# EAGLE schematic shield Arduino (EAGLE 6.1)
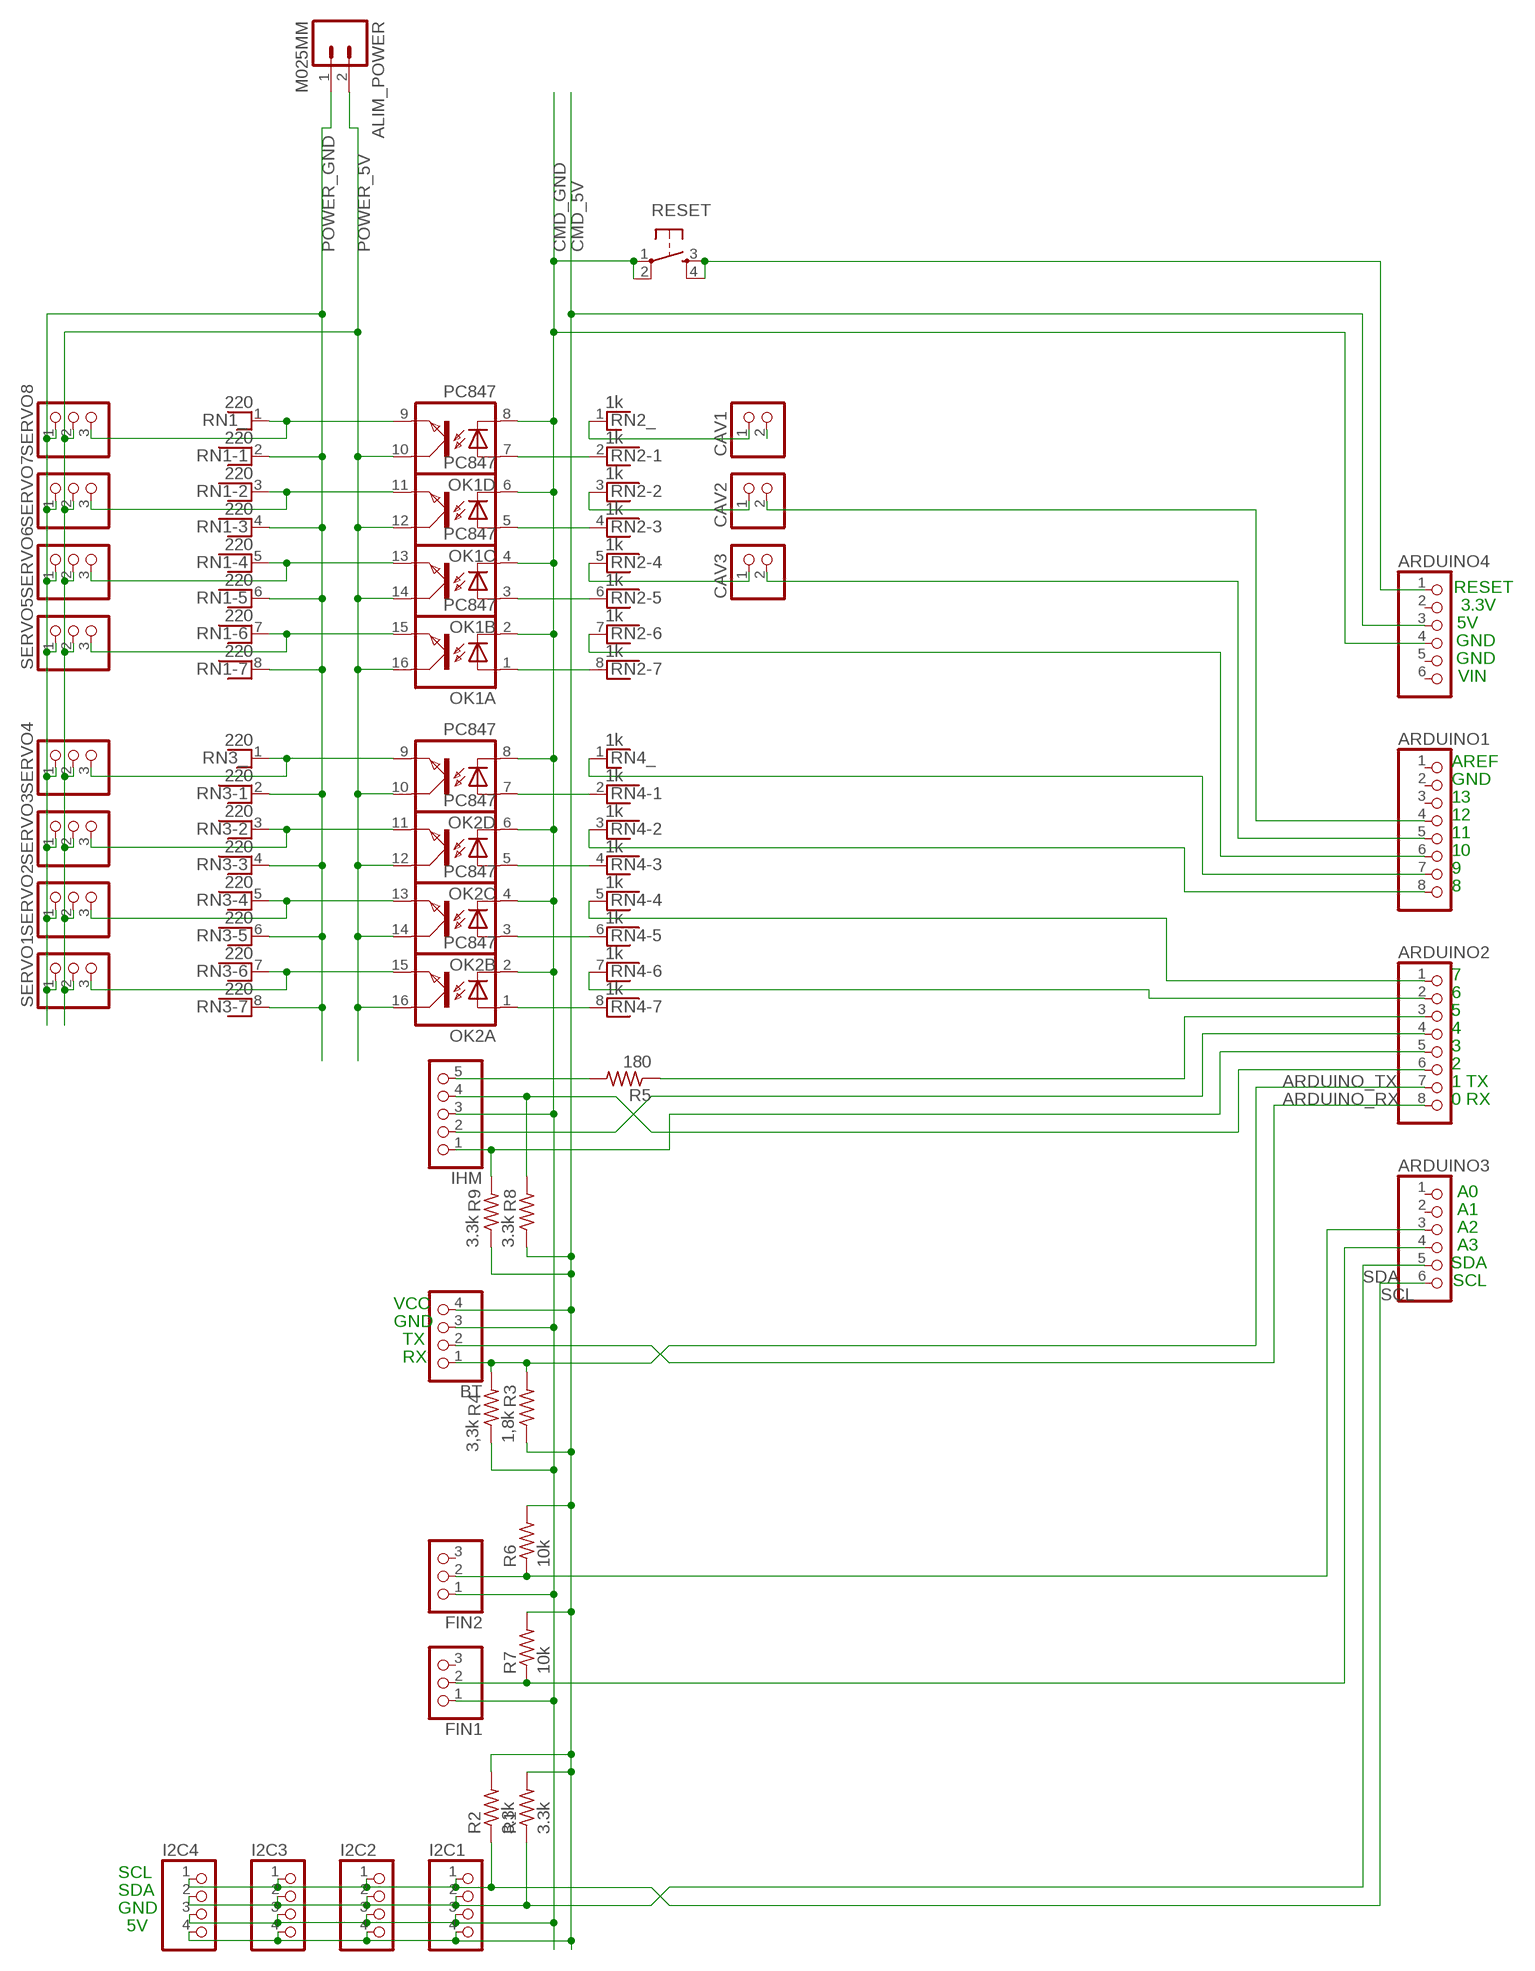
[diagram p0: schematic, sheet 1]

## Parts
ALIM_POWER  M025MM  [SCREWTERMINAL-5MM-2]
ARDUINO1  PINHD-1X8  [1X08]
ARDUINO2  PINHD-1X8  [1X08]
ARDUINO3  PINHD-1X6  [1X06]
ARDUINO4  PINHD-1X6  [1X06]
BT  PINHD-1X4  [1X04]
CAV1  PINHD-1X2  [1X02]
CAV2  PINHD-1X2  [1X02]
CAV3  PINHD-1X2  [1X02]
FIN1  PINHD-1X3  [1X03]
FIN2  PINHD-1X3  [1X03]
I2C1  PINHD-1X4  [1X04]
I2C2  PINHD-1X4  [1X04]
I2C3  PINHD-1X4  [1X04]
I2C4  PINHD-1X4  [1X04]
IHM  PINHD-1X5  [1X05]
OK1  PC847  [DIL16]
OK2  PC847  [DIL16]
R1  3.3k  R-US_0204/7  [0204/7]
R2  3.3k  R-US_0204/7  [0204/7]
R3  1,8k  R-US_0204/7  [0204/7]
R4  3,3k  R-US_0204/7  [0204/7]
R5  180  R-US_0204/7  [0204/7]
R6  10k  R-US_0204/7  [0204/7]
R7  10k  R-US_0204/7  [0204/7]
R8  3.3k  R-US_0204/7  [0204/7]
R9  3.3k  R-US_0204/7  [0204/7]
RESET  TAC_SWITCHPTH  [TACTILE-PTH]
RN1  220  RNX7  [RN-8]
RN2  1k  RNX7  [RN-8]
RN3  220  RNX7  [RN-8]
RN4  1k  RNX7  [RN-8]
SERVO1  PINHD-1X3  [1X03]
SERVO2  PINHD-1X3  [1X03]
SERVO3  PINHD-1X3  [1X03]
SERVO4  PINHD-1X3  [1X03]
SERVO5  PINHD-1X3  [1X03]
SERVO6  PINHD-1X3  [1X03]
SERVO7  PINHD-1X3  [1X03]
SERVO8  PINHD-1X3  [1X03]

## Nets
ARDUINO_RX: ARDUINO2.8 BT.2
ARDUINO_TX: ARDUINO2.7 BT.1 R3.2 R4.2
CMD_5V: ARDUINO4.3 BT.4 I2C1.4 I2C2.4 I2C3.4 I2C4.4 R1.2 R2.2 R3.1 R6.2 R7.2 R8.1 R9.1
CMD_GND: ARDUINO4.4 BT.3 FIN1.1 FIN2.1 I2C1.3 I2C2.3 I2C3.3 I2C4.3 IHM.3 OK1.2(A:C) OK1.4(B:C) OK1.6(C:C) OK1.8(D:C) OK2.2(A:C) OK2.4(B:C) OK2.6(C:C) OK2.8(D:C) R4.1 RESET.1 RESET.2
N$1: CAV1.2
N$2: OK2.7(D:A) RN4.2
N$3: ARDUINO1.4 CAV2.2
N$4: OK2.5(C:A) RN4.4
N$5: OK2.3(B:A) RN4.6
N$6: OK1.15(A:EMIT) RN1.7 SERVO5.3
N$7: OK1.9(D:EMIT) RN1.1 SERVO8.3
N$8: ARDUINO1.5 CAV3.2
N$9: OK2.1(A:A) RN4.8
N$10: OK1.11(C:EMIT) RN1.3 SERVO7.3
N$11: OK1.13(B:EMIT) RN1.5 SERVO6.3
N$12: OK1.1(A:A) RN2.8
N$13: OK1.3(B:A) RN2.6
N$14: OK1.5(C:A) RN2.4
N$15: OK1.7(D:A) RN2.2
N$16: CAV1.1 RN2.1
N$17: CAV2.1 RN2.3
N$18: CAV3.1 RN2.5
N$19: ARDUINO1.6 RN2.7
N$20: OK2.15(A:EMIT) RN3.7 SERVO1.3
N$21: OK2.9(D:EMIT) RN3.1 SERVO4.3
N$22: OK2.11(C:EMIT) RN3.3 SERVO3.3
N$23: OK2.13(B:EMIT) RN3.5 SERVO2.3
N$24: ARDUINO4.1 RESET.3 RESET.4
N$28: ARDUINO1.7 RN4.1
N$29: ARDUINO1.8 RN4.3
N$30: ARDUINO2.1 RN4.5
N$31: ARDUINO2.2 RN4.7
N$33: IHM.5 R5.2
N$34: ARDUINO3.4 FIN1.2 R7.1
N$35: ARDUINO3.3 FIN2.2 R6.1
N$36: ARDUINO2.3 R5.1
N$37: ARDUINO2.5 IHM.1 R9.2
N$38: ARDUINO2.4 IHM.2
N$39: ARDUINO2.6 IHM.4 R8.2
POWER_5V: ALIM_POWER.2 OK1.10(D:COL) OK1.12(C:COL) OK1.14(B:COL) OK1.16(A:COL) OK2.10(D:COL) OK2.12(C:COL) OK2.14(B:COL) OK2.16(A:COL) SERVO1.2 SERVO2.2 SERVO3.2 SERVO4.2 SERVO5.2 SERVO6.2 SERVO7.2 SERVO8.2
POWER_GND: ALIM_POWER.1 RN1.2 RN1.4 RN1.6 RN1.8 RN3.2 RN3.4 RN3.6 RN3.8 SERVO1.1 SERVO2.1 SERVO3.1 SERVO4.1 SERVO5.1 SERVO6.1 SERVO7.1 SERVO8.1
SCL: ARDUINO3.6 I2C1.1 I2C2.1 I2C3.1 I2C4.1 R2.1
SDA: ARDUINO3.5 I2C1.2 I2C2.2 I2C3.2 I2C4.2 R1.1
Unconnected: ARDUINO1.1 ARDUINO1.2 ARDUINO1.3 ARDUINO3.1 ARDUINO3.2 ARDUINO4.2 ARDUINO4.5 ARDUINO4.6 FIN1.3 FIN2.3

## Notes on the sheet
- RESET
- 3.3V
- 5V
- GND
- GND
- VIN
- AREF
- GND
- 13
- 12
- 11
- 10
- 9
- 8
- 7
- 6
- 5
- 4
- 3
- 2
- 1 TX
- 0 RX
- A0
- A1
- A2
- A3
- SDA
- SCL
- VCC
- GND
- TX
- RX
- SCL
- SDA
- GND
- 5V

## Library data of the parts
ALIM_POWER = SparkFun-Connectors:M02: Standard 2-pin 0.1" header. Use with - straight break away headers ( PRT-00116) - right angle break away headers (PRT-00553) - swiss pins (PRT-00743) - machine pins (PRT-00117) - female headers (PRT-00115) Molex polarized connector foot print use with: PRT-08233 with associated crimp pins and housings. 2.54_SCREWTERM for use with PRT-10571. 3.5mm Screw Terminal footprints for PRT-08084 5mm Screw Terminal footprints for use with PRT-08433
ARDUINO1 ARDUINO2 = pinhead:PINHD-1X8: PIN HEADER
ARDUINO3 ARDUINO4 = pinhead:PINHD-1X6: PIN HEADER
BT I2C1-I2C4 = pinhead:PINHD-1X4: PIN HEADER
CAV1-CAV3 = pinhead:PINHD-1X2: PIN HEADER
FIN1 FIN2 SERVO1-SERVO8 = pinhead:PINHD-1X3: PIN HEADER
IHM = pinhead:PINHD-1X5: PIN HEADER
OK1 OK2 = optocoupler:PC847: SHARP OPTO COUPLER; OC_FARNELL: 9707735; OC_NEWARK: unknown
R1-R9 = resistor:R-US_: RESISTOR, American symbol
RESET = SparkFun-Electromechanical:TAC_SWITCH: Momentary Switch Button commonly used for reset or general input. Spark Fun Electronics SKU : COM-00097 SMT- SWCH-08247
RN1-RN4 = resistor-net:RNX7: RESISTOR NETWORK; OC_FARNELL: unknown; OC_NEWARK: unknown